# Altium schematic sheet SensorBoardShield_Actuator.SchDoc
size A4; SheetNumber: 1; SheetTotal: 1
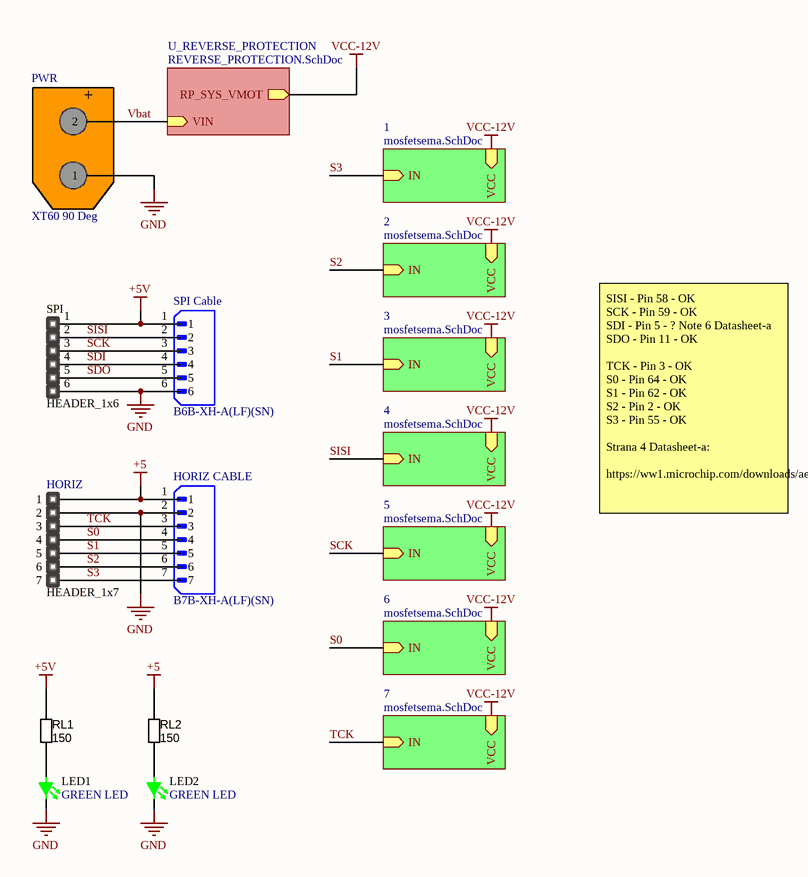
[diagram p0: SensorBoardShield_Actuator.SchDoc]

## Parts
HORIZ  HEADER_1x7  [HDR1X7]
HORIZ_CABLE  B7B-XH-A(LF)(SN)  [JST_B7B-XH-A(LF)(SN)]
LED1  GREEN LED  [DIOC1608X04N]
LED2  GREEN LED  [DIOC1608X04N]
PWR  XT60 90 Deg  [XT60PW-M]
RL1  150  [RES_0603]
RL2  150  [RES_0603]
SPI  HEADER_1x6  [HM1X6]
SPI_Cable  B6B-XH-A(LF)(SN)  [JST_B6B-XH-A(LF)(SN)]

## Sub-sheets
1 = mosfetsema.SchDoc: IN (in), VCC (in)
2 = mosfetsema.SchDoc: IN (in), VCC (in)
3 = mosfetsema.SchDoc: IN (in), VCC (in)
4 = mosfetsema.SchDoc: IN (in), VCC (in)
5 = mosfetsema.SchDoc: IN (in), VCC (in)
6 = mosfetsema.SchDoc: IN (in), VCC (in)
7 = mosfetsema.SchDoc: IN (in), VCC (in)
U_REVERSE_PROTECTION = REVERSE_PROTECTION.SchDoc: VIN (in), RP_SYS_VMOT (out)

## Nets
+5: HORIZ.1 HORIZ_CABLE.1 RL2.2
+5V: RL1.2 SPI.1 SPI_Cable.1
GND: HORIZ.2 HORIZ_CABLE.2 LED1.2 LED2.2 PWR.1 SPI.6 SPI_Cable.6
VCC-12V: sheet 1/VCC, sheet 3/VCC, sheet 2/VCC, sheet 4/VCC, sheet 5/VCC, sheet 6/VCC, sheet 7/VCC, sheet U_REVERSE_PROTECTION/RP_SYS_VMOT
S0: HORIZ.4 HORIZ_CABLE.4 ; sheet 6/IN
S1: HORIZ.5 HORIZ_CABLE.5 ; sheet 3/IN
S2: HORIZ.6 HORIZ_CABLE.6 ; sheet 2/IN
S3: HORIZ.7 HORIZ_CABLE.7 ; sheet 1/IN
SCK: SPI.3 SPI_Cable.3 ; sheet 5/IN
SDI: SPI.4 SPI_Cable.4
SDO: SPI.5 SPI_Cable.5
SISI: SPI.2 SPI_Cable.2 ; sheet 4/IN
TCK: HORIZ.3 HORIZ_CABLE.3 ; sheet 7/IN
Vbat: PWR.2 ; sheet U_REVERSE_PROTECTION/VIN
NetLED1_1: LED1.1 RL1.1
NetLED2_1: LED2.1 RL2.1

## Notes on the sheet
- SISI - Pin 58 - OK
  SCK - Pin 59 - OK
  SDI - Pin 5 - ? Note 6 Datasheet-a
  SDO - Pin 11 - OK
  TCK - Pin 3 - OK
  S0 - Pin 64 - OK
  S1 - Pin 62 - OK
  S2 - Pin 2 - OK
  S3 - Pin 55 - OK
  Strana 4 Datasheet-a:
  https://ww1.microchip.com/downloads/aemDocuments/documents/MCU32/ProductDocuments/DataSheets/PIC32MK-GP-MC-Family-Data-Sheet-DS60001402H.pdf
- (in symbol XT60PW-M) +

## Library data of the parts
HORIZ = Header 7: Header, 7-Pin; LatestRevisionDate: 17-Jul-2002; LatestRevisionNote: Re-released for DXP Platform.; Publisher: Altium Limited
HORIZ_CABLE = B7B-XH-A(LF)(SN): Connector Header Through Hole 7 position 0.098 (2.50mm); MF: JST Sales; SnapEDA_Link: https://www.snapeda.com/parts/B7B-XH-A%20(LF)(SN)/JST+Sales+America+Inc./view-part/?ref=snap; Package: None; Value: *; MP: B7B-XH-A (LF)(SN); Check_prices: https://www.snapeda.com/parts/B7B-XH-A%20(LF)(SN)/JST+Sales+America+Inc./view-part/?ref=eda
LED1 LED2 = 00000001: LED GREEN DIFFUSED 0603 SMD; Supplier 1: Avnet; Supplier Part Number 1: Q65111A3964; ComponentLink1Description: Digikey; ComponentLink1URL: https://www.digikey.com/en/products/detail/ams-osram-usa-inc/LG-Q396-PS-35/5249855
PWR = XT60PW-M
RL1 RL2 = R000004: RES 150 OHM 1% 1/10W 0603; resistance: 1Kohm; ComponentLink1Description: digikey; ComponentLink1URL: https://www.digikey.com/en/products/detail/vishay-beyschlag-draloric-bc-components/MCT06030C1001FP500/2607821
SPI_Cable = B6B-XH-A(LF)(SN): Connector Header Through Hole 6 position 0.098 (2.50mm); MF: JST Sales; SnapEDA_Link: https://www.snapeda.com/parts/B6B-XH-A(LF)(SN)/JST+Sales+America+Inc./view-part/?ref=snap; Package: None; Value: *; MP: B6B-XH-A(LF)(SN); Check_prices: https://www.snapeda.com/parts/B6B-XH-A(LF)(SN)/JST+Sales+America+Inc./view-part/?ref=eda